# EAGLE board element (EAGLE 8.0.1), part 1 of 2
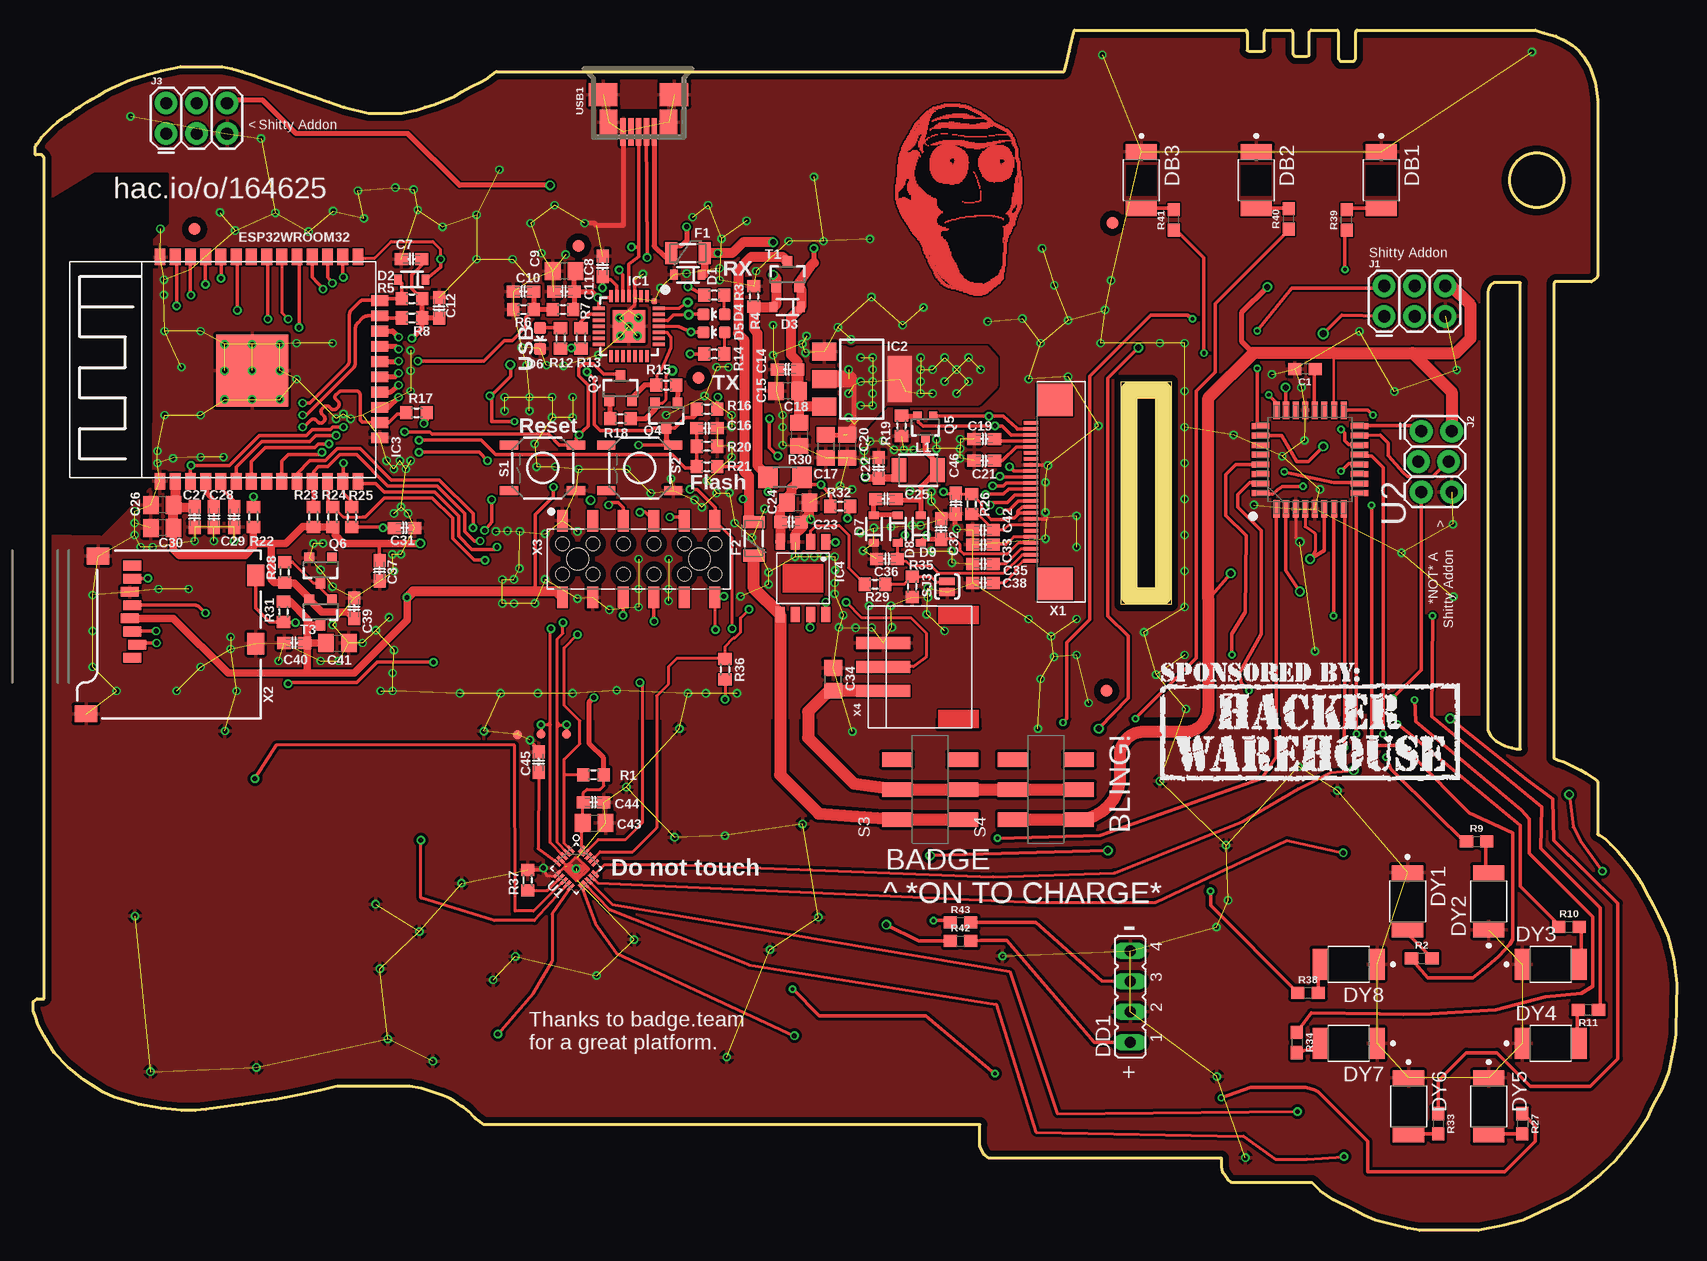
[diagram p3: board, top side]
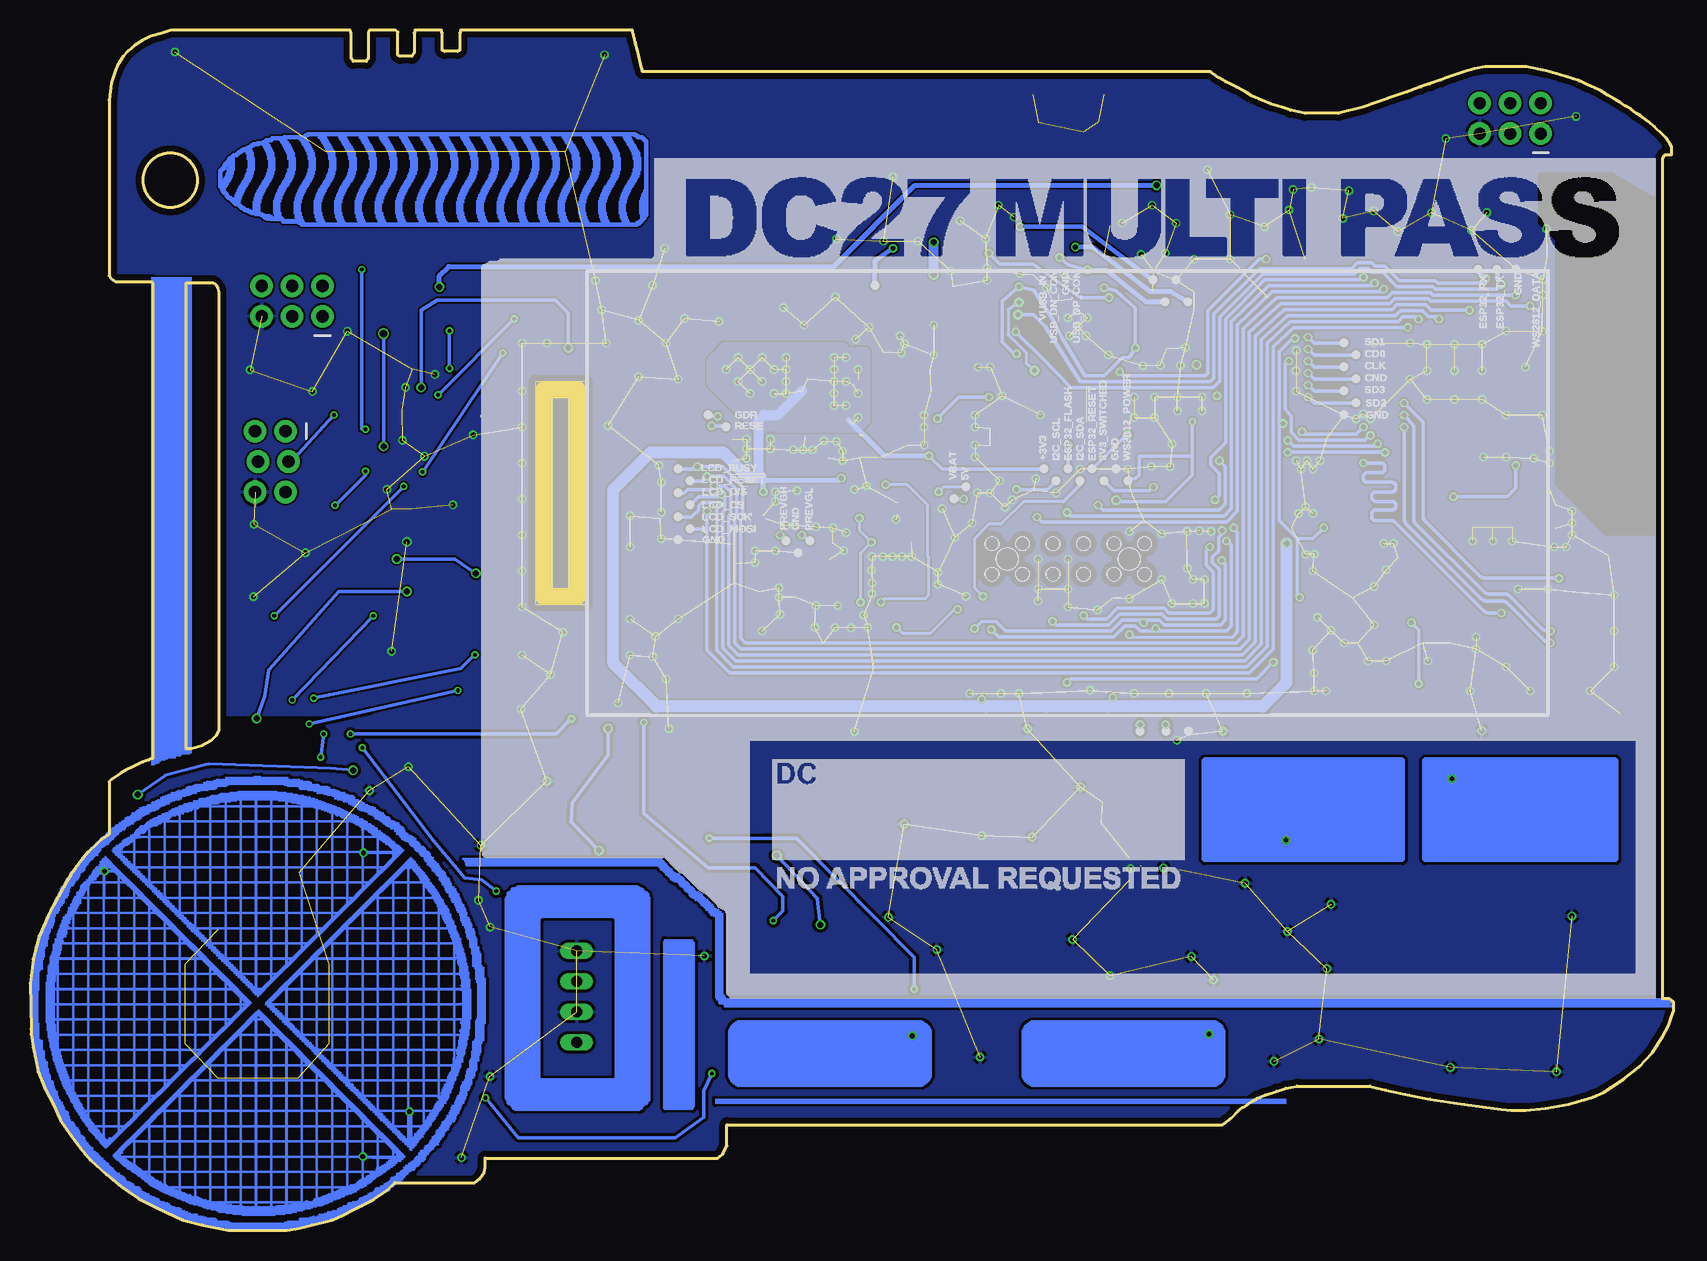
[diagram p4: board, bottom side, seen from below]

Size 136.98 x 100.07 mm. Coordinates in mm from the lower left corner, seen from the top.
Outline: 90.66,69.56 90.66,70.76
Outline: 90.66,70.76 94.86,70.76 94.86,52.16 90.66,52.16 90.66,70.76
Outline: 0.93,19.3 0.93,89.4 0.85,89.48 arc90 0.68,89.65 0.25,89.65 arc-90 0.17,89.74 0.17,90.33 arc-90 0.25,90.42 0.25,90.5 arc-90 0.34,90.58 0.68,91.09 0.93,91.35 1.61,92.02 2.03,92.36 2.37,92.62 2.71,92.87 3.13,93.12 3.56,93.46 3.98,93.72 4.49,94.06 4.91,94.31 5.5,94.65 6.1,94.99 6.6,95.24 7.2,95.49 7.87,95.83 9.48,96.34 10.67,96.68 12.28,97.02 15.75,97.02 16.59,96.85 17.44,96.6 18.46,96.26 19.39,95.92 20.32,95.58 21.08,95.33 22.18,94.9 23.54,94.48 24.72,94.06 25.91,93.63 27.94,93.12 30.73,93.12 31.92,93.38 32.68,93.63 33.53,93.89 35.13,94.56 35.73,94.9 36.49,95.33 37.33,95.75 37.93,96.09 38.27,96.34 38.6,96.6 85.93,96.6 86.1,97.19 86.18,97.53 86.35,98.29 86.52,99.05 86.61,99.39 86.69,99.73 86.78,100.07 101.08,100.07 101.17,99.81 101.17,98.37 101.34,98.29 102.44,98.29 102.61,98.37 102.61,99.81 102.69,100.07 104.89,100.07 104.98,99.81 104.98,98.12 105.15,97.87 106.16,97.87 106.33,97.95 106.33,99.9 106.5,100.07 108.7,100.07 108.79,99.9 108.79,97.7 108.96,97.44 110.06,97.44 110.23,97.7 110.23,99.81 110.31,100.07 125.21,100.07 125.97,99.81 126.9,99.56 127.58,99.22 128.26,98.8 128.85,98.29 129.19,97.87 129.7,97.1 129.95,96.43 130.2,95.66 130.37,94.23 130.37,79.58 130.29,79.41 130.12,79.24 129.87,79.07 126.82,79.07 126.73,78.9 126.73,39.37 127.07,39.2 127.58,39.03 128.34,38.69 129.02,38.35 129.44,38.1 130.2,37.59 130.37,37.42 130.37,33.02 130.54,32.93 130.8,32.76 131.05,32.59 131.47,32.17 132.07,31.58 132.58,30.99 133.17,30.22 133.59,29.63 134.01,28.95 134.61,27.85 135.03,27.09 135.45,26.24 135.79,25.48 136.22,24.55 136.47,23.62 136.72,22.6 136.89,21.25 136.98,20.57 136.89,16.76 136.89,16.34 136.72,15.24 136.55,14.48 136.3,13.21 135.71,11.77 135.03,10.5 134.44,9.23 133.59,7.96 132.74,6.86 131.9,5.84 130.63,4.66 129.36,3.64 127.92,2.62 126.4,1.86 124.19,0.85 122.59,0.42 120.47,0 115.56,0 114.54,0.17 113.53,0.42 111.83,0.85 110.9,1.27 110.06,1.69 108.36,2.54 107.26,3.3 106.59,3.98 99.9,3.98 99.56,4.23 99.14,4.83 99.05,5.25 99.05,6.01 79.66,6.01 79.24,6.35 78.9,7.03 78.9,8.8 37.59,8.8 37.25,9.06 36.83,9.4 36.32,9.91 35.9,10.24 35.73,10.33 35.13,10.75 34.71,11.01 34.12,11.26 33.1,11.6 32.34,11.85 31.41,12.02 25.31,12.02 23.96,11.68 22.01,11.26 20.32,10.92 17.44,10.5 14.39,10.07 13.55,9.99 12.36,9.99 10.67,10.16 8.8,10.5 6.77,11.09 5.84,11.51 4.23,12.53 2.88,13.63 1.78,14.82 0.93,16.17 0.42,17.1 0.17,17.86 0,18.29 0,19.05 0.34,19.3 0.93,19.3
Outline: 123.94,40.13 123.94,78.99 121.74,78.99 121.48,78.82 121.32,78.56 121.23,78.22 121.23,41.65 121.48,41.23 121.91,40.81 122.67,40.38 123.26,40.21 123.6,40.13 123.94,40.13
Outline: circle at 125.29,87.54 radius 2.25
Copper layers (1*16): Top 0.035mm / dielectric 1.6mm / Bottom 0.035mm
Design rules "Elecrow_2-layer_PCB_eagle_rule": minimum track width 6mil, minimum drill 12mil, track to track 6mil, track to pad 6mil, pad to pad 6mil, via to via 8mil, smd to smd 0mil, copper to edge 20mil, drill to drill 10mil, minimum pad ring 6mil, minimum via ring 6mil, stop-mask expansion 0mil, vias tented up to drill 100mil, thermal gap 10mil
Net classes: 0 default: width 0.3 mm, clearance 0.3 mm; 1 FAT: width 0.2 mm, drill 0.4 mm, clearance 0.3 mm; 2 GND/3V3: width 0.2 mm, drill 0.4 mm; 3 Touch: width 0.2 mm, clearance 0.6 mm; 4 touch prox: width 0.2 mm, clearance 1.6 mm
Holes 1.8 mm at 45.38,55.96 55.54,55.96
tRestrict: area 0.7,58.1 to 11.2,88.1
bRestrict: area 0.8,58.1 to 11.2,88.1
Milling: 4 lines

## Footprints (pad centres in the part's own frame; a part is rotated, then mirrored left to right if it is on the bottom)
VIA = drill 0.4 pad 0.705: P$1 0,0
0603 = smd 1.1 x 1: 1 -0.85,0; 2 0.85,0
C0603-DASHES = smd 1.1 x 1: 1 -0.85,0; 2 0.85,0
C0805 = smd 1.3 x 1.5: 1 -0.95,0; 2 0.95,0
SOD-323 = smd 0.63 x 0.83: A 1.15,0; C -1.15,0
LED-0603 = smd 1 x 1: A 0,-0.877; C 0,0.877
LED_LYT77K-K2M1-26-Z = smd 1.2 x 2.6: 1 -2.4,0; 2 2.4,0
JP4 = drill 0.914 long: 1 -3.81,0; 2 -1.27,0; 3 1.27,0; 4 3.81,0
PTC-1206 = smd 1 x 1.8: 1 -1.4,0; 2 1.4,0
FIDUCIAL_1MM = smd 1 x 1: 1 0,0
MLP28 = smd 1 x 0.3: 1 -2.5,1.5; 2 -2.5,1; 3 -2.5,0.5; 4 -2.5,0; 5 -2.5,-0.5; 6 -2.5,-1; 7 -2.5,-1.5; 15 2.5,-1.5; 16 2.5,-1; 17 2.5,-0.5; 18 2.5,0; 19 2.5,0.5; 20 2.5,1; 21 2.5,1.5 | smd 0.3 x 1: 8 -1.5,-2.5; 9 -1,-2.5; 10 -0.5,-2.5; 11 0,-2.5; 12 0.5,-2.5; 13 1,-2.5; 14 1.5,-2.5; 22 1.5,2.5; 23 1,2.5; 24 0.5,2.5; 25 0,2.5; 26 -0.5,2.5; 27 -1,2.5; 28 -1.5,2.5 | smd 2.7 x 2.7: EXP 0,0 | smd 0.435 x 0.435: M -2.103,2.103
SOT223 = smd 1.5 x 2: 1 -2.3,-3.15; 2 0,-3.15; 3 2.3,-3.15 | smd 3.8 x 2: 4 0,3.15
ESP32MOD = smd 6 x 6: 0 9.9,12.3 | smd 1.4 x 0.9: 1 0.68,19.99; 2 0.68,18.72; 3 0.68,17.45; 4 0.68,16.18; 5 0.68,14.91; 6 0.68,13.64; 7 0.68,12.37; 8 0.68,11.1; 9 0.68,9.83; 10 0.68,8.56; 11 0.68,7.29; 12 0.68,6.02; 13 0.68,4.75; 14 0.68,3.48; 25 19.38,3.48; 26 19.38,4.75; 27 19.38,6.02; 28 19.38,7.29; 29 19.38,8.56; 30 19.38,9.83; 31 19.38,11.1; 32 19.38,12.37; 33 19.38,13.64; 34 19.38,14.91; 35 19.38,16.18; 36 19.38,17.45; 37 19.38,18.72; 38 19.38,19.99 | smd 0.9 x 1.4: 15 4.31,1.68; 16 5.58,1.68; 17 6.85,1.68; 18 8.12,1.68; 19 9.39,1.68; 20 10.66,1.68; 21 11.93,1.68; 22 13.2,1.68; 23 14.47,1.68; 24 15.74,1.68
SOP-8 = smd 1.27 x 0.76: 1 -3.035,1.905; 2 -3.035,0.635; 3 -3.035,-0.635; 4 -3.035,-1.905; 5 3.035,-1.905; 6 3.035,-0.635; 7 3.035,0.635; 8 3.035,1.905
2X3 = drill 1.016 pad 1.88: 1 0,0; 2 0,2.54; 3 2.54,0; 4 2.54,2.54; 5 5.08,0; 6 5.08,2.54
2X3_LOCK = drill 1.016 pad 1.88: 1 0,0.127; 2 0,2.667; 3 2.54,-0.127; 4 2.54,2.413; 5 5.08,0.127; 6 5.08,2.667
1210 = smd 1.2 x 2: 1 -1.6,0; 2 1.6,0
SOT23-3 = smd 0.8 x 0.9: 1 -0.95,-1; 2 0.95,-1; 3 0,1.1
SOT323 = smd 0.7 x 0.7: 1 -0.65,-0.925; 2 0.65,-0.925; 3 0,0.925
R0603-DASHES = smd 1 x 1.1: 1 -0.85,0; 2 0.85,0
R1206 = smd 1.6 x 1.803: 1 -1.422,0; 2 1.422,0
TACTILE-SWITCH-SMD = smd 1.524 x 0.762: 1 -2.794,1.905; 2 2.794,1.905; 3 -2.794,-1.905; 4 2.794,-1.905
SW_JS202011SCQN = smd 1.2 x 2.5: 1 -2.5,-2.75; 2 0,-2.75; 3 2.5,-2.75; 4 -2.5,2.75; 5 0,2.75; 6 2.5,2.75
PAD-JUMPER-2-NO_YES_SILK = smd 0.635 x 1.27: 1 -0.45,0; 2 0.45,0
PAD.03X.03 = smd 0.762 x 0.762: P$1 0,0
QFN40P300X300X60-20N = smd 0.711 x 0.254: 1 -1.448,0.787; 2 -1.448,0.406; 3 -1.448,0; 4 -1.448,-0.406; 5 -1.448,-0.787; 11 1.448,-0.787; 12 1.448,-0.406; 13 1.448,0; 14 1.448,0.406; 15 1.448,0.787 | smd 0.254 x 0.711: 6 -0.787,-1.448; 7 -0.406,-1.448; 8 0,-1.448; 9 0.406,-1.448; 10 0.787,-1.448; 16 0.787,1.448; 17 0.406,1.448; 18 0,1.448; 19 -0.406,1.448; 20 -0.787,1.448
QFP80P900X900X120-32N = smd 1.473 x 0.508: 1 -4.115,2.794; 2 -4.115,2.007; 3 -4.115,1.194; 4 -4.115,0.406; 5 -4.115,-0.406; 6 -4.115,-1.194; 7 -4.115,-2.007; 8 -4.115,-2.794; 17 4.115,-2.794; 18 4.115,-2.007; 19 4.115,-1.194; 20 4.115,-0.406; 21 4.115,0.406; 22 4.115,1.194; 23 4.115,2.007; 24 4.115,2.794 | smd 0.508 x 1.473: 9 -2.794,-4.115; 10 -2.007,-4.115; 11 -1.194,-4.115; 12 -0.406,-4.115; 13 0.406,-4.115; 14 1.194,-4.115; 15 2.007,-4.115; 16 2.794,-4.115; 25 2.794,4.115; 26 2.007,4.115; 27 1.194,4.115; 28 0.406,4.115; 29 -0.406,4.115; 30 -1.194,4.115; 31 -2.007,4.115; 32 -2.794,4.115
MOLEX-47364-0001 = smd 2.3 x 0.45: 1 3.1,1.3; 2 3.1,0.65; 3 3.1,0; 4 3.1,-0.65; 5 3.1,-1.3 | smd 1.9 x 2.375: GND1 0,2.95; GND4 0,-2.95 | smd 2.1 x 1.475: GND2 2.3,2.5; GND3 2.3,-2.5
68712414022 = smd 0.3 x 1.2: 1 -5.75,0.6; 2 -5.25,0.6; 3 -4.75,0.6; 4 -4.25,0.6; 5 -3.75,0.6; 6 -3.25,0.6; 7 -2.75,0.6; 8 -2.25,0.6; 9 -1.75,0.6; 10 -1.25,0.6; 11 -0.75,0.6; 12 -0.25,0.6; 13 0.25,0.6; 14 0.75,0.6; 15 1.25,0.6; 16 1.75,0.6; 17 2.25,0.6; 18 2.75,0.6; 19 3.25,0.6; 20 3.75,0.6; 21 4.25,0.6; 22 4.75,0.6; 23 5.25,0.6; 24 5.75,0.6 | smd 2.7 x 3: 25 -7.68,-1.38; 26 7.68,-1.38
MICRO-SD-SOCKET-PP = smd 0.8 x 1.5: 1 -8.94,10.7; 2 -7.84,10.3; 3 -6.74,10.7; 4 -5.64,10.9; 5 -4.54,10.7; 6 -3.44,10.9; 7 -2.34,10.7; 8 -1.24,10.7 | smd 1.8 x 1.4: CD1 -2.05,0.4; CD2 -7.75,0.4 | smd 1.4 x 1.9: GND1 -13.6,14.55; GND3 -0.45,13.55
610X12243021 = smd 0.9 x 1.8: 1 -6.35,3.2; 2 -3.81,3.2; 3 -1.27,3.2; 4 1.27,3.2; 5 3.81,3.2; 6 6.35,3.2; 7 6.35,-3.2; 8 3.81,-3.2; 9 1.27,-3.2; 10 -1.27,-3.2; 11 -3.81,-3.2; 12 -6.35,-3.2 | hole 1.1: -6.35,1.27; -3.81,1.27; -3.81,-1.27; -6.35,-1.27; -1.27,1.27; -1.27,-1.27; 1.27,1.27; 1.27,-1.27; 3.81,1.27; 3.81,-1.27; 6.35,1.27; 6.35,-1.27
JST-PH3 = smd 1 x 4.5: 1 2,0; 2 0,0; 3 -2,0

## Placement (x,y rotation side)
$$U$1  VIA  [VIA]  65.44,26.09 0 top
$$U$2  VIA  [VIA]  93.9,37.45 0 top
$$U$3  VIA  [VIA]  28.9,21.81 0 top
$$U$4  VIA  [VIA]  28.55,27.18 0 top
$$U$5  VIA  [VIA]  8.49,26.21 0 top
$$U$6  VIA  [VIA]  99.41,32.1 0 top
$$U$7  VIA  [VIA]  61.41,23.39 0 top
$$U$8  VIA  [VIA]  42.52,30.2 0 top
$$U$9  VIA  [VIA]  53.85,41.81 0 top
C1  0.1uF  [0603]  105.99,71.79 180 top
C7  100n  [C0603-DASHES]  31.55,80.96 180 top
C8  100n  [C0603-DASHES]  47.46,80.36 90 top
C9  4u7/16V  [C0805]  44.26,79.96 180 top
C10  100n  [C0603-DASHES]  40.86,78.26 180 top
C11  100n  [C0603-DASHES]  44.26,78.26 180 top
C12  100n  [C0603-DASHES]  33.85,76.9 90 top
C14  100n  [C0603-DASHES]  62.86,71.76 180 top
C15  4u7/16V  [C0805]  62.86,69.96 180 top
C16  100n  [C0603-DASHES]  56.16,66.86 0 top
C17  4u7/16V  [C0805]  66.06,65.36 270 top
C18  4u7/16V  [C0805]  63.86,66.36 270 top
C19  1u  [C0603-DASHES]  79.26,65.96 0 top
C20  4u7/16V  [C0805]  67.86,65.36 270 top
C21  1u  [C0603-DASHES]  79.26,64.16 0 top
C22  100n  [C0603-DASHES]  70.46,63.56 90 top
C23  100n  [C0603-DASHES]  63.16,59.06 180 top
C24  4u7/16V  [C0805]  63.76,60.66 0 top
C25  1u  [C0603-DASHES]  71.06,60.96 0 top
C26  4u7/16V  [C0805]  10.76,60.46 180 top
C27  100n  [C0603-DASHES]  13.46,59.46 270 top
C28  100n  [C0603-DASHES]  15.06,59.46 90 top
C29  100n  [C0603-DASHES]  16.76,59.46 90 top
C30  4u7/16V  [C0805]  10.76,58.56 180 top
C31  100n  [C0603-DASHES]  30.96,58.56 0 top
C32  1u  [C0603-DASHES]  75.66,58.46 270 top
C33  1u  [C0603-DASHES]  79.16,57.16 0 top
C34  4u7/16V  [C0805]  66.68,45.93 90 top
C35  1u  [C0603-DASHES]  79.16,55.56 0 top
C36  1u  [C0603-DASHES]  71.16,55.96 0 top
C37  100n  [C0603-DASHES]  28.88,54.99 270 top
C38  1u  [C0603-DASHES]  79.16,53.96 0 top
C39  1u  [C0603-DASHES]  26.76,51.86 90 top
C40  100n  [C0603-DASHES]  21.76,48.96 180 top
C41  4u7/16V  [C0805]  25.36,48.96 0 top
C42  1u  [C0603-DASHES]  79.16,58.36 180 top
C43  4u7/16V  [C0805]  46.76,33.97 0 top
C44  100n  [C0603-DASHES]  46.72,35.68 0 top
C45  100n  [C0603-DASHES]  42.14,39.04 90 top
C46  1u  [C0603-DASHES]  76.9,60.58 270 top
D1  SD05-7  [SOD-323]  54.56,79.66 180 top
D2  NSVR0320MW2T1G  [SOD-323]  31.56,79.26 180 top
D3  NSVR0320MW2T1G  [SOD-323]  62.86,76.96 180 top
D4  Yellow  [LED-0603]  56.76,76.36 90 top
D5  RED  [LED-0603]  56.76,74.86 90 top
D6  green  [LED-0603]  42.26,74.36 180 top
D7  NSVR0320MW2T1G  [SOD-323]  70.06,58.46 90 top
D8  NSVR0320MW2T1G  [SOD-323]  72.06,58.46 270 top
D9  NSVR0320MW2T1G  [SOD-323]  73.96,58.46 90 top
DB1  LYT77K-K2M1-26-Z  [LED_LYT77K-K2M1-26-Z]  112.34,87.54 270 top
DB2  LYT77K-K2M1-26-Z  [LED_LYT77K-K2M1-26-Z]  101.93,87.54 270 top
DB3  LYT77K-K2M1-26-Z  [LED_LYT77K-K2M1-26-Z]  92.36,87.54 270 top
DD1  [JP4]  91.43,19.47 90 top
DY1  LYT77K-K2M1-26-Z  [LED_LYT77K-K2M1-26-Z]  114.54,27.43 270 top
DY2  LYT77K-K2M1-26-Z  [LED_LYT77K-K2M1-26-Z]  121.32,27.43 90 top
DY3  LYT77K-K2M1-26-Z  [LED_LYT77K-K2M1-26-Z]  126.48,22.18 0 top
DY4  LYT77K-K2M1-26-Z  [LED_LYT77K-K2M1-26-Z]  126.48,15.58 0 top
DY5  LYT77K-K2M1-26-Z  [LED_LYT77K-K2M1-26-Z]  121.32,10.33 270 top
DY6  LYT77K-K2M1-26-Z  [LED_LYT77K-K2M1-26-Z]  114.63,10.33 270 top
DY7  LYT77K-K2M1-26-Z  [LED_LYT77K-K2M1-26-Z]  109.63,15.58 180 top
DY8  LYT77K-K2M1-26-Z  [LED_LYT77K-K2M1-26-Z]  109.63,22.18 180 top
F1  1A  [PTC-1206]  54.56,81.46 0 top
F2  1A  [PTC-1206]  60.06,57.66 90 top
FD1  FIDUCIAL  [FIDUCIAL_1MM]  89.96,83.96 0 top
FD2  FIDUCIAL  [FIDUCIAL_1MM]  13.46,83.46 0 top
FD3  FIDUCIAL  [FIDUCIAL_1MM]  45.46,82.06 0 top
FD4  FIDUCIAL  [FIDUCIAL_1MM]  55.46,71.06 0 top
FD5  FIDUCIAL  [FIDUCIAL_1MM]  89.46,44.96 0 top
IC1  CP210X_USB_UART  [MLP28]  49.66,75.36 270 top
IC2  AP2114H  [SOT223]  69.06,70.96 270 top
IC3  ESP32WROOM32  [ESP32MOD]  30.56,61.76 90 top
IC4  TP4056  [SOP-8]  64.16,54.36 270 top
J1  FEMALE 2x3  [2X3]  112.6,76.19 0 top
J2  AVR_SPI_PROG_3X22X3_LOCK  [2X3_LOCK]  115.56,66.63 270 top
J3  FEMALE 2x3  [2X3]  11.09,91.43 0 top
L1  47µ  [1210]  73.76,63.36 0 top
Q3  MMBT2222A  [SOT23-3]  48.96,70.16 0 top
Q4  MMBT2222A  [SOT23-3]  52.76,67.96 180 top
Q5  SI1304 BDL  [SOT323]  74.36,66.96 180 top
Q6  MMBT2222A  [SOT23-3]  23.96,55.06 180 top
R1  100k  [R0603-DASHES]  46.71,37.97 0 top
R2  300  [0603]  115.73,22.69 0 top
R3  1k  [R0603-DASHES]  56.76,77.96 180 top
R4  10k  [R0603-DASHES]  60.06,77.86 270 top
R5  10k  [R0603-DASHES]  31.56,77.66 0 top
R6  100k  [R0603-DASHES]  40.86,76.76 0 top
R7  220k  [R0603-DASHES]  44.16,76.76 0 top
R8  10k  [R0603-DASHES]  31.56,76.06 0 top
R9  300  [0603]  120.3,32.42 0 top
R10  300  [0603]  128,25.31 0 top
R11  300  [0603]  129.61,18.37 180 top
R12  1k  [R0603-DASHES]  43.96,74.36 270 top
R13  10k  [R0603-DASHES]  45.66,74.36 90 top
R14  1k  [R0603-DASHES]  56.76,73.06 180 top
R15  10k  [R0603-DASHES]  52.76,70.46 0 top
R16  10k  [R0603-DASHES]  56.16,68.46 0 top
R17  10k  [R0603-DASHES]  31.96,68.16 0 top
R18  10k  [R0603-DASHES]  48.96,67.66 180 top
R19  2R7  [R0603-DASHES]  72.36,67.06 270 top
R20  100k  [R0603-DASHES]  56.16,65.36 180 top
R21  220k  [R0603-DASHES]  56.16,63.66 0 top
R22  10k  [R0603-DASHES]  18.36,59.46 90 top
R23  4k7  [R0603-DASHES]  23.36,59.46 90 top
R24  4k7  [R0603-DASHES]  24.96,59.46 90 top
R25  10k  [R0603-DASHES]  26.56,59.46 270 top
R26  0R  [R0603-DASHES]  78.22,60.54 270 top
R27  300  [0603]  124.11,8.89 270 top
R28  10k  [R0603-DASHES]  20.96,54.86 270 top
R29  1.2k  [R0603-DASHES]  70.16,53.86 0 top
R30  0R27 1/4W  [R1206]  62.66,62.76 0 top
R31  100k  [R0603-DASHES]  20.86,51.56 270 top
R32  10k  [R0603-DASHES]  67.26,60.36 180 top
R33  300  [0603]  117.08,8.89 270 top
R34  300  [0603]  105.31,15.66 270 top
R35  1.2k  [R0603-DASHES]  73.26,53.66 270 top
R36  100k  [R0603-DASHES]  57.66,46.76 270 top
R37  75k 1%  [R0603-DASHES]  41.22,29.18 270 top
R38  300  [0603]  106.25,19.81 0 top
R39  300  [0603]  109.46,84.23 90 top
R40  300  [0603]  104.64,84.32 90 top
R41  300  [0603]  95.07,84.23 90 top
R42  300  [0603]  77.29,24.13 0 top
R43  300  [0603]  77.29,25.65 0 top
S1  SWITCH-MOMENTARY-2SMD  [TACTILE-SWITCH-SMD]  42.46,63.56 180 top
S2  SWITCH-MOMENTARY-2SMD  [TACTILE-SWITCH-SMD]  50.56,63.56 180 top
S3  JS202011SCQN  [SW_JS202011SCQN]  74.75,36.74 90 top
S4  JS202011SCQN  [SW_JS202011SCQN]  84.4,36.74 90 top
SJ3  JUMPER-PAD-2-NOYES_SILK  [PAD-JUMPER-2-NO_YES_SILK]  76.16,53.66 90 top
T1  [SOT23-3]  62.86,79.66 0 top
T3  [SOT23-3]  23.96,51.56 180 top
TP1  TEST-POINT3  [PAD.03X.03]  40.37,41.32 0 top
TP2  TEST-POINT3  [PAD.03X.03]  42.33,41.35 180 top
TP3  TEST-POINT3  [PAD.03X.03]  44.46,41.35 0 top
TP100  TEST-POINT3  [PAD.03X.03]  44.46,41.6 0 bottom
TP101  TEST-POINT3  [PAD.03X.03]  42.33,41.61 180 bottom
TP102  TEST-POINT3  [PAD.03X.03]  40.42,41.61 0 bottom
TP103  TEST-POINT3  [PAD.03X.03]  72.96,56.46 0 bottom
TP104  TEST-POINT3  [PAD.03X.03]  73.96,57.46 0 bottom
TP105  TEST-POINT3  [PAD.03X.03]  71.96,57.46 0 bottom
TP106  TEST-POINT3  [PAD.03X.03]  82.96,57.56 0 bottom
TP107  TEST-POINT3  [PAD.03X.03]  81.96,58.46 0 bottom
TP108  TEST-POINT3  [PAD.03X.03]  82.96,59.46 0 bottom
TP109  TEST-POINT3  [PAD.03X.03]  81.96,60.46 0 bottom
TP110  TEST-POINT3  [PAD.03X.03]  59.96,60.96 0 bottom
TP111  TEST-POINT3  [PAD.03X.03]  82.96,61.46 0 bottom
TP112  TEST-POINT3  [PAD.03X.03]  58.96,61.96 0 bottom
TP113  TEST-POINT3  [PAD.03X.03]  81.96,62.46 0 bottom
TP114  TEST-POINT3  [PAD.03X.03]  51.46,62.46 0 bottom
TP115  TEST-POINT3  [PAD.03X.03]  49.46,62.46 0 bottom
TP116  TEST-POINT3  [PAD.03X.03]  47.46,62.46 0 bottom
TP117  TEST-POINT3  [PAD.03X.03]  45.46,62.46 0 bottom
TP118  TEST-POINT3  [PAD.03X.03]  82.96,63.46 0 bottom
TP119  TEST-POINT3  [PAD.03X.03]  52.46,63.46 0 bottom
TP120  TEST-POINT3  [PAD.03X.03]  50.46,63.46 0 bottom
TP121  TEST-POINT3  [PAD.03X.03]  48.46,63.46 0 bottom
TP122  TEST-POINT3  [PAD.03X.03]  46.46,63.46 0 bottom
TP123  TEST-POINT3  [PAD.03X.03]  78.96,66.96 0 bottom
TP124  TEST-POINT3  [PAD.03X.03]  80.46,67.96 0 bottom
TP125  TEST-POINT3  [PAD.03X.03]  27.46,67.96 0 bottom
TP126  TEST-POINT3  [PAD.03X.03]  26.46,68.96 0 bottom
TP127  TEST-POINT3  [PAD.03X.03]  27.46,69.96 0 bottom
TP128  TEST-POINT3  [PAD.03X.03]  26.46,70.96 0 bottom
TP129  TEST-POINT3  [PAD.03X.03]  66.57,78.75 270 bottom
TP130  TEST-POINT3  [PAD.03X.03]  27.46,71.96 0 bottom
TP131  TEST-POINT3  [PAD.03X.03]  26.46,72.96 0 bottom
TP132  TEST-POINT3  [PAD.03X.03]  27.46,73.96 0 bottom
TP133  TEST-POINT3  [PAD.03X.03]  16.3,80.12 0 bottom
TP134  TEST-POINT3  [PAD.03X.03]  14.72,80.12 0 bottom
TP135  TEST-POINT3  [PAD.03X.03]  13.13,80.12 0 bottom
TP137  TEST-POINT3  [PAD.03X.03]  42.4,77.38 0 bottom
TP138  TEST-POINT3  [PAD.03X.03]  40.48,77.38 0 bottom
TP139  TEST-POINT3  [PAD.03X.03]  43.4,79.23 0 bottom
TP140  TEST-POINT3  [PAD.03X.03]  41.48,79.23 0 bottom
U1  MPR121QR2  [QFN40P300X300X60-20N]  45.27,30.16 315 top
U2  ATMEGA48-20AU  [QFP80P900X900X120-32N]  106.42,64.26 90 top
U$2  VIA  [VIA]  53.46,32.76 0 top
U$3  VIA  [VIA]  15.99,41.63 0 top
U$4  VIA  [VIA]  108.69,36.66 0 top
U$5  VIA  [VIA]  49.44,36.95 0 top
U$6  VIA  [VIA]  35.71,28.94 0 top
U$10  VIA  [VIA]  80.78,22.86 0 top
U$11  VIA  [VIA]  32.19,24.91 0 top
U$12  VIA  [VIA]  40.19,22.82 0 top
U$13  VIA  [VIA]  50.09,24.24 0 top
U$14  VIA  [VIA]  38.35,20.88 0 top
U$15  VIA  [VIA]  98.64,12.82 0 top
U$16  VIA  [VIA]  9.77,13.22 0 top
U$17  VIA  [VIA]  64.13,33.87 0 top
U$18  VIA  [VIA]  18.61,13.58 0 top
U$19  VIA  [VIA]  29.57,15.96 0 top
U$20  VIA  [VIA]  33.31,14.1 0 top
U$21  VIA  [VIA]  57.81,14.44 0 top
U$22  VIA  [VIA]  101.02,6.05 0 top
U$23  VIA  [VIA]  37.57,41.61 0 top
USB1  MOLEX-47346-0001  [MOLEX-47364-0001]  50.46,94.67 270 top
X1  [68712414022]  83.76,61.56 90 top
X2  2908-05WB-MG  [MICRO-SD-SOCKET-PP]  18.96,56.66 90 top
X3  [610X12243021]  50.46,55.96 0 top
X4  JST-PH3  [JST-PH3]  70.86,46.96 270 top